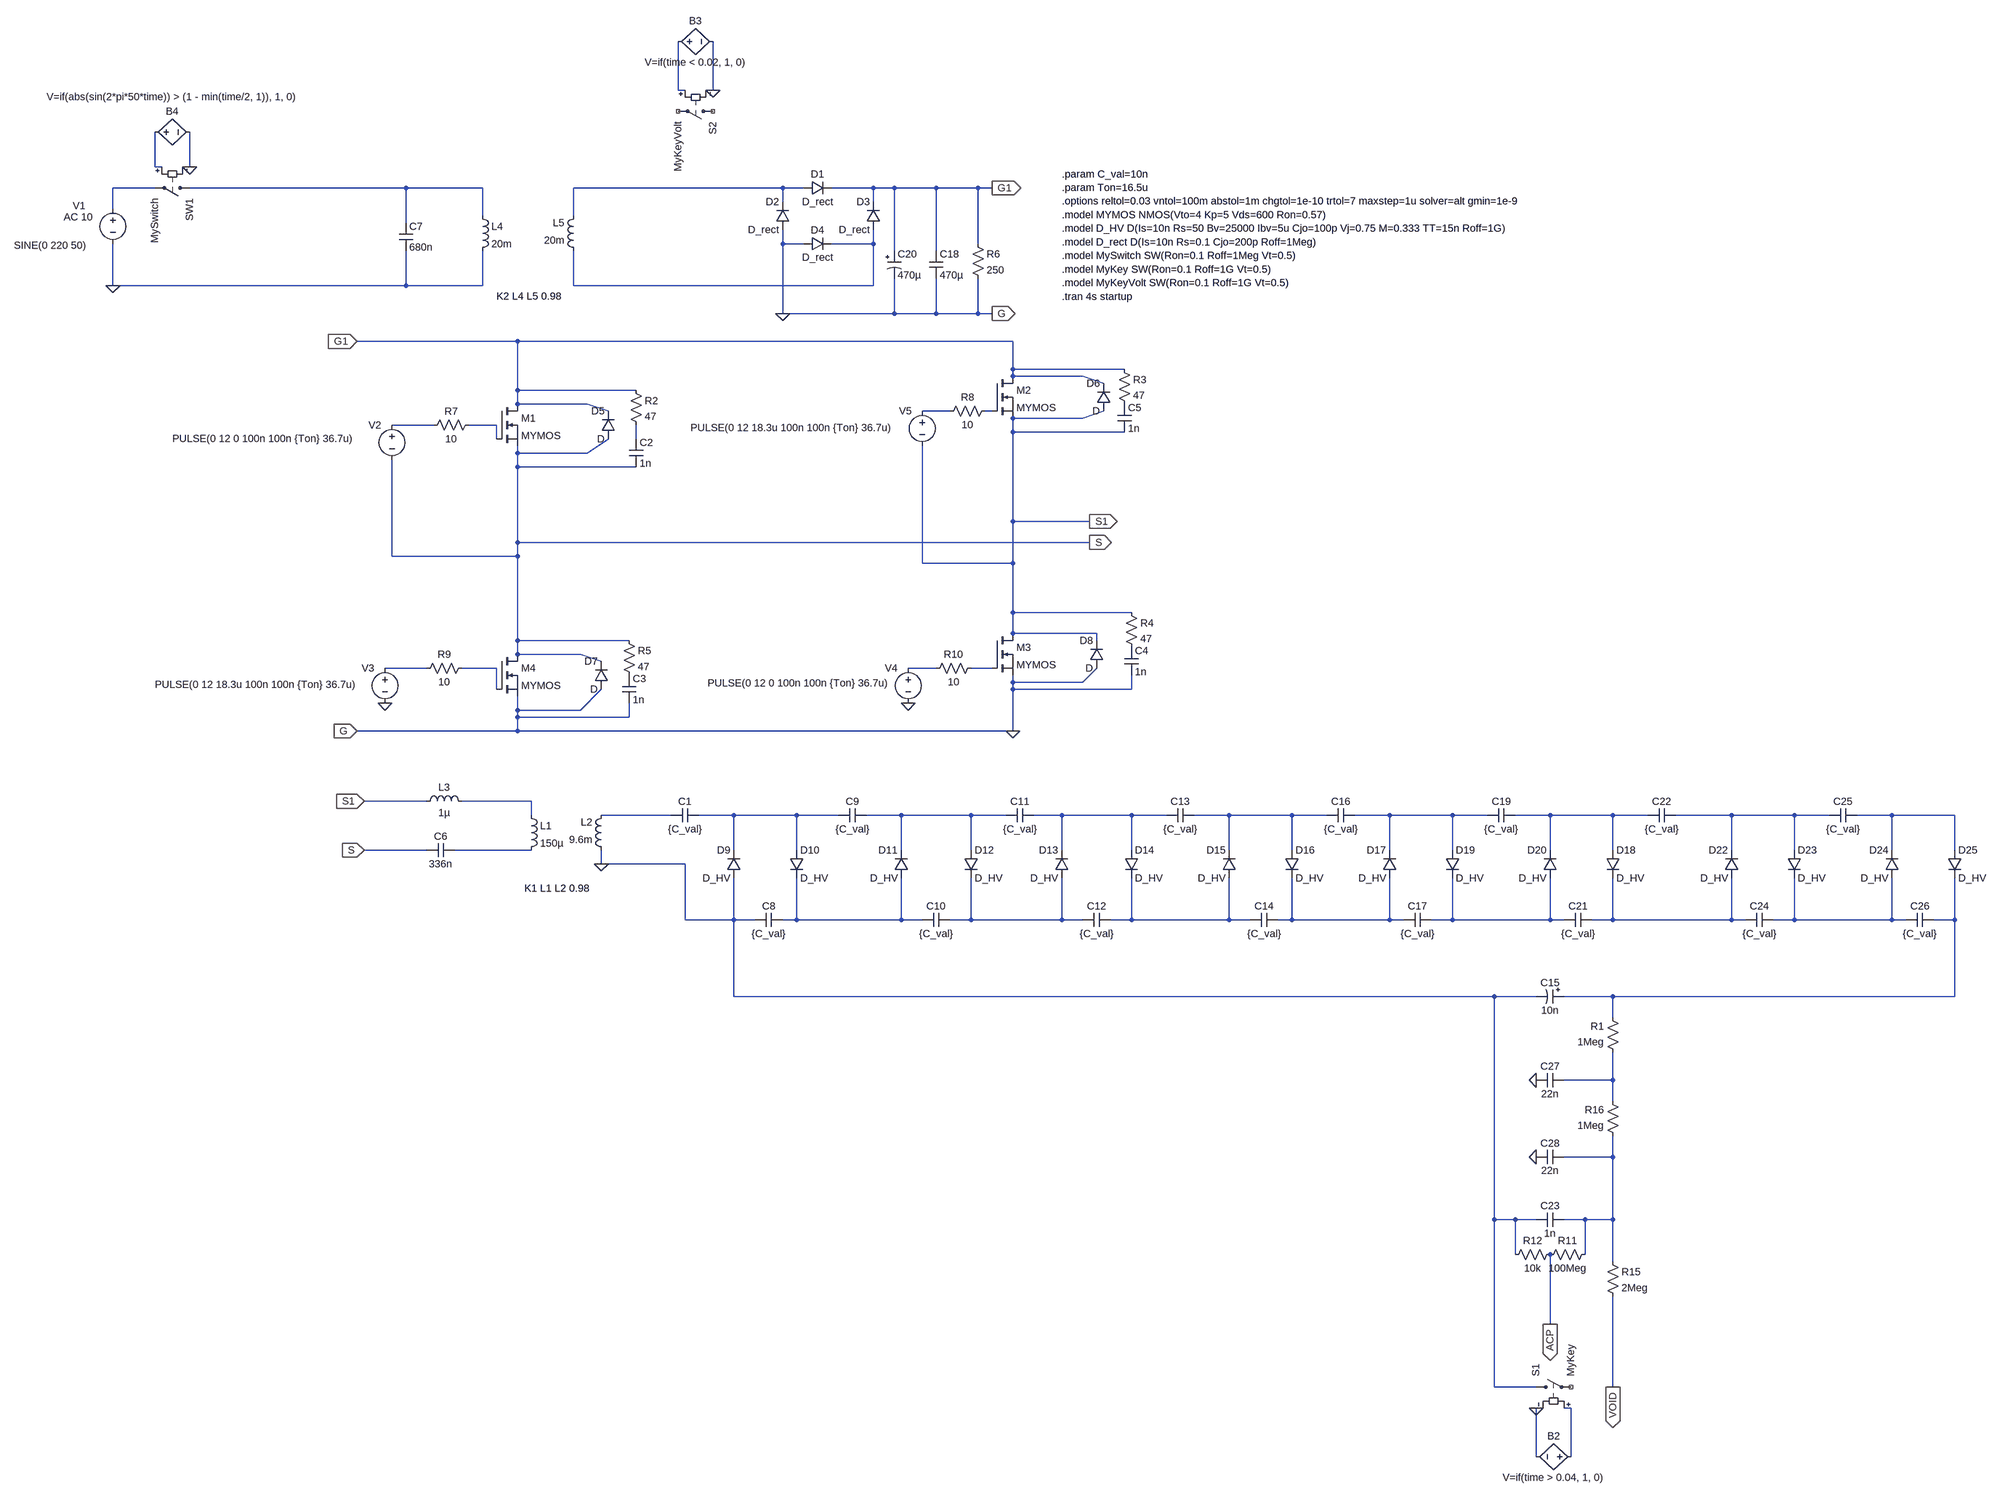
[diagram p0: schematic Higt.asc]
Higt.asc, the LTspice schematic file:
Version 4.1
SHEET 1 3056 2752
WIRE -448 -592 -448 -704
WIRE -432 -592 -448 -592
WIRE -368 -592 -368 -704
WIRE -368 -592 -384 -592
WIRE -1648 -416 -1648 -496
WIRE -1632 -416 -1648 -416
WIRE -1568 -416 -1568 -496
WIRE -1568 -416 -1584 -416
WIRE -1648 -368 -1744 -368
WIRE -1072 -368 -1568 -368
WIRE -896 -368 -1072 -368
WIRE -208 -368 -688 -368
WIRE -160 -368 -208 -368
WIRE 0 -368 -96 -368
WIRE 48 -368 0 -368
WIRE 144 -368 48 -368
WIRE 240 -368 144 -368
WIRE 272 -368 240 -368
WIRE -208 -336 -208 -368
WIRE 0 -336 0 -368
WIRE -1744 -320 -1744 -368
WIRE -896 -304 -896 -368
WIRE -688 -304 -688 -368
WIRE -1072 -288 -1072 -368
WIRE -208 -240 -208 -272
WIRE -160 -240 -208 -240
WIRE 0 -240 0 -272
WIRE 0 -240 -96 -240
WIRE 240 -240 240 -368
WIRE 48 -224 48 -368
WIRE 144 -224 144 -368
WIRE -1744 -144 -1744 -240
WIRE -1072 -144 -1072 -224
WIRE -1072 -144 -1744 -144
WIRE -896 -144 -896 -224
WIRE -896 -144 -1072 -144
WIRE -688 -144 -688 -224
WIRE 0 -144 0 -240
WIRE 0 -144 -688 -144
WIRE -208 -80 -208 -240
WIRE 48 -80 48 -160
WIRE 48 -80 -208 -80
WIRE 144 -80 144 -160
WIRE 144 -80 48 -80
WIRE 240 -80 240 -160
WIRE 240 -80 144 -80
WIRE 272 -80 240 -80
WIRE -816 -16 -1184 -16
WIRE 320 -16 -816 -16
WIRE 320 48 320 -16
WIRE 576 48 320 48
WIRE 320 64 320 48
WIRE 480 64 320 64
WIRE 528 80 480 64
WIRE -816 96 -816 -16
WIRE -544 96 -816 96
WIRE -816 128 -816 96
WIRE -656 128 -816 128
WIRE -608 144 -656 128
WIRE 176 144 112 144
WIRE 272 144 256 144
WIRE 480 160 528 144
WIRE 480 160 320 160
WIRE -1008 176 -1104 176
WIRE -864 176 -928 176
WIRE 320 192 320 160
WIRE 576 192 320 192
WIRE -864 208 -864 176
WIRE -544 208 -544 176
WIRE -816 240 -816 224
WIRE -656 240 -608 208
WIRE -656 240 -816 240
WIRE -816 272 -816 240
WIRE -544 272 -816 272
WIRE 320 432 320 192
WIRE 496 432 320 432
WIRE -816 480 -816 272
WIRE 496 480 -816 480
WIRE -1104 512 -1104 256
WIRE -816 512 -816 480
WIRE -816 512 -1104 512
WIRE 112 528 112 224
WIRE 320 528 320 432
WIRE 320 528 112 528
WIRE 320 736 320 528
WIRE 592 736 320 736
WIRE 320 784 320 736
WIRE 512 784 320 784
WIRE -816 800 -816 512
WIRE -560 800 -816 800
WIRE 512 800 512 784
WIRE -816 832 -816 800
WIRE -672 832 -816 832
WIRE -624 848 -672 832
WIRE -1024 864 -1120 864
WIRE -864 864 -944 864
WIRE 144 864 80 864
WIRE 272 864 224 864
WIRE 320 896 320 880
WIRE 480 896 512 864
WIRE 480 896 320 896
WIRE -864 912 -864 864
WIRE 320 912 320 896
WIRE 592 912 592 880
WIRE 592 912 320 912
WIRE -816 960 -816 928
WIRE -672 960 -624 912
WIRE -672 960 -816 960
WIRE -816 976 -816 960
WIRE -560 976 -560 944
WIRE -560 976 -816 976
WIRE -816 1008 -816 976
WIRE -816 1008 -1184 1008
WIRE 320 1008 320 912
WIRE 320 1008 -816 1008
WIRE -1024 1184 -1168 1184
WIRE -784 1184 -944 1184
WIRE -784 1216 -784 1184
WIRE -464 1216 -624 1216
WIRE -320 1216 -400 1216
WIRE -176 1216 -320 1216
WIRE -80 1216 -176 1216
WIRE 64 1216 -16 1216
WIRE 224 1216 64 1216
WIRE 304 1216 224 1216
WIRE 432 1216 368 1216
WIRE 592 1216 432 1216
WIRE 672 1216 592 1216
WIRE 816 1216 736 1216
WIRE 960 1216 816 1216
WIRE 1040 1216 960 1216
WIRE 1184 1216 1104 1216
WIRE 1328 1216 1184 1216
WIRE 1408 1216 1328 1216
WIRE 1552 1216 1472 1216
WIRE 1696 1216 1552 1216
WIRE 1776 1216 1696 1216
WIRE 1968 1216 1840 1216
WIRE 2112 1216 1968 1216
WIRE 2192 1216 2112 1216
WIRE 2336 1216 2256 1216
WIRE 2480 1216 2336 1216
WIRE -1024 1296 -1168 1296
WIRE -784 1296 -960 1296
WIRE -320 1296 -320 1216
WIRE -176 1296 -176 1216
WIRE 64 1296 64 1216
WIRE 224 1296 224 1216
WIRE 432 1296 432 1216
WIRE 592 1296 592 1216
WIRE 816 1296 816 1216
WIRE 960 1296 960 1216
WIRE 1184 1296 1184 1216
WIRE 1328 1296 1328 1216
WIRE 1552 1296 1552 1216
WIRE 1696 1296 1696 1216
WIRE 1968 1296 1968 1216
WIRE 2112 1296 2112 1216
WIRE 2336 1296 2336 1216
WIRE 2480 1296 2480 1216
WIRE -624 1328 -624 1296
WIRE -432 1328 -624 1328
WIRE -432 1456 -432 1328
WIRE -320 1456 -320 1360
WIRE -320 1456 -432 1456
WIRE -272 1456 -320 1456
WIRE -176 1456 -176 1360
WIRE -176 1456 -208 1456
WIRE 64 1456 64 1360
WIRE 64 1456 -176 1456
WIRE 112 1456 64 1456
WIRE 224 1456 224 1360
WIRE 224 1456 176 1456
WIRE 432 1456 432 1360
WIRE 432 1456 224 1456
WIRE 480 1456 432 1456
WIRE 592 1456 592 1360
WIRE 592 1456 544 1456
WIRE 816 1456 816 1360
WIRE 816 1456 592 1456
WIRE 864 1456 816 1456
WIRE 960 1456 960 1360
WIRE 960 1456 928 1456
WIRE 1184 1456 1184 1360
WIRE 1184 1456 960 1456
WIRE 1216 1456 1184 1456
WIRE 1328 1456 1328 1360
WIRE 1328 1456 1280 1456
WIRE 1552 1456 1552 1360
WIRE 1552 1456 1328 1456
WIRE 1584 1456 1552 1456
WIRE 1696 1456 1696 1360
WIRE 1696 1456 1648 1456
WIRE 1968 1456 1968 1360
WIRE 1968 1456 1696 1456
WIRE 2000 1456 1968 1456
WIRE 2112 1456 2112 1360
WIRE 2112 1456 2064 1456
WIRE 2336 1456 2336 1360
WIRE 2336 1456 2112 1456
WIRE 2368 1456 2336 1456
WIRE 2480 1456 2480 1360
WIRE 2480 1456 2432 1456
WIRE -320 1632 -320 1456
WIRE 1424 1632 -320 1632
WIRE 1520 1632 1424 1632
WIRE 1696 1632 1584 1632
WIRE 2480 1632 2480 1456
WIRE 2480 1632 1696 1632
WIRE 1696 1680 1696 1632
WIRE 1696 1824 1696 1760
WIRE 1696 1824 1584 1824
WIRE 1696 1872 1696 1824
WIRE 1696 2000 1696 1952
WIRE 1696 2000 1584 2000
WIRE 1424 2144 1424 1632
WIRE 1472 2144 1424 2144
WIRE 1520 2144 1472 2144
WIRE 1632 2144 1584 2144
WIRE 1696 2144 1696 2000
WIRE 1696 2144 1632 2144
WIRE 1472 2224 1472 2144
WIRE 1632 2224 1632 2144
WIRE 1696 2240 1696 2144
WIRE 1552 2384 1552 2224
WIRE 1424 2528 1424 2144
WIRE 1520 2528 1424 2528
WIRE 1696 2528 1696 2320
WIRE 1536 2576 1520 2576
WIRE 1600 2576 1584 2576
WIRE 1520 2688 1520 2576
WIRE 1600 2688 1600 2576
FLAG -1120 944 0
FLAG 80 944 0
FLAG -624 1328 0
FLAG 272 -80 G
IOPIN 272 -80 Out
FLAG 272 -368 G1
IOPIN 272 -368 Out
FLAG -1184 -16 G1
IOPIN -1184 -16 In
FLAG -1184 1008 G
IOPIN -1184 1008 In
FLAG 496 432 S1
IOPIN 496 432 Out
FLAG -1168 1184 S1
IOPIN -1168 1184 In
FLAG 496 480 S
IOPIN 496 480 Out
FLAG -1168 1296 S
IOPIN -1168 1296 In
FLAG 320 1008 0
FLAG -208 -80 0
FLAG -1744 -144 0
FLAG 1552 2384 ACP
IOPIN 1552 2384 Out
FLAG 1520 2576 0
FLAG -368 -592 0
FLAG 1696 2528 VOID
IOPIN 1696 2528 Out
FLAG 1520 1824 0
FLAG 1520 2000 0
FLAG -1568 -416 0
SYMBOL voltage -1744 -336 R0
WINDOW 123 -113 35 Left 2
WINDOW 39 0 0 Left 0
WINDOW 0 -92 9 Left 2
WINDOW 3 -227 100 Left 2
SYMATTR Value2 AC 10
SYMATTR InstName V1
SYMATTR Value SINE(0 220 50)
SYMBOL diode -160 -352 R270
WINDOW 0 32 32 VTop 2
WINDOW 3 0 32 VBottom 2
SYMATTR InstName D1
SYMATTR Value D_rect
SYMBOL diode -192 -272 R180
WINDOW 0 24 64 Left 2
WINDOW 3 24 0 Left 2
SYMATTR InstName D2
SYMATTR Value D_rect
SYMBOL diode 16 -272 R180
WINDOW 0 24 64 Left 2
WINDOW 3 24 0 Left 2
SYMATTR InstName D3
SYMATTR Value D_rect
SYMBOL diode -160 -224 R270
WINDOW 0 32 32 VTop 2
WINDOW 3 0 32 VBottom 2
SYMATTR InstName D4
SYMATTR Value D_rect
SYMBOL voltage -1104 160 M0
WINDOW 3 87 47 Left 2
SYMATTR Value PULSE(0 12 0 100n 100n {Ton} 36.7u)
SYMATTR InstName V2
SYMBOL voltage -1120 848 M0
WINDOW 3 64 53 Left 2
SYMATTR Value PULSE(0 12 18.3u 100n 100n {Ton} 36.7u)
SYMATTR InstName V3
SYMBOL voltage 80 848 M0
WINDOW 3 44 50 Left 2
SYMATTR Value PULSE(0 12 0 100n 100n {Ton} 36.7u)
SYMATTR InstName V4
SYMBOL voltage 112 128 M0
WINDOW 3 68 54 Left 2
SYMATTR Value PULSE(0 12 18.3u 100n 100n {Ton} 36.7u)
SYMATTR InstName V5
SYMBOL ind -800 1200 R0
SYMATTR InstName L1
SYMATTR Value 150µ
SYMATTR Type ind
SYMATTR SpiceLine Rser=0.05
SYMBOL ind -608 1312 R180
WINDOW 0 36 80 Left 2
WINDOW 3 36 40 Left 2
SYMATTR InstName L2
SYMATTR Value 9.6m
SYMATTR Type ind
SYMATTR SpiceLine Rser=300 Cpar=16p
SYMBOL diode -592 208 R180
WINDOW 0 24 64 Left 2
WINDOW 3 24 0 Left 2
SYMATTR InstName D5
SYMBOL diode 544 144 R180
WINDOW 0 24 64 Left 2
WINDOW 3 24 0 Left 2
SYMATTR InstName D6
SYMBOL diode -608 912 R180
WINDOW 0 24 64 Left 2
WINDOW 3 24 0 Left 2
SYMATTR InstName D7
SYMBOL diode 528 864 R180
WINDOW 0 24 64 Left 2
WINDOW 3 24 0 Left 2
SYMATTR InstName D8
SYMBOL nmos -864 128 R0
SYMATTR InstName M1
SYMATTR Value MYMOS
SYMBOL nmos 272 64 R0
SYMATTR InstName M2
SYMATTR Value MYMOS
SYMBOL nmos 272 784 R0
SYMATTR InstName M3
SYMATTR Value MYMOS
SYMBOL nmos -864 832 R0
SYMATTR InstName M4
SYMATTR Value MYMOS
SYMBOL res -560 80 R0
SYMATTR InstName R2
SYMATTR Value 47
SYMBOL cap -560 208 R0
SYMATTR InstName C2
SYMATTR Value 1n
SYMBOL res 560 32 R0
SYMATTR InstName R3
SYMATTR Value 47
SYMBOL res 576 720 R0
SYMATTR InstName R4
SYMATTR Value 47
SYMBOL res -576 784 R0
SYMATTR InstName R5
SYMATTR Value 47
SYMBOL cap -576 880 R0
SYMATTR InstName C3
SYMATTR Value 1n
SYMBOL cap 576 816 R0
SYMATTR InstName C4
SYMATTR Value 1n
SYMBOL cap 560 128 R0
SYMATTR InstName C5
SYMATTR Value 1n
SYMBOL res 224 -256 R0
SYMATTR InstName R6
SYMATTR Value 250
SYMBOL cap -1088 -288 R0
SYMATTR InstName C7
SYMATTR Value 680n
SYMATTR SpiceLine Rser=2
SYMBOL polcap 32 -224 R0
SYMATTR InstName C20
SYMATTR Value 470µ
SYMATTR SpiceLine Rser=0.01
SYMBOL cap -400 1200 R90
WINDOW 0 0 32 VBottom 2
WINDOW 3 32 32 VTop 2
SYMATTR InstName C1
SYMATTR Value {C_val}
SYMBOL diode -304 1360 R180
WINDOW 0 24 64 Left 2
WINDOW 3 24 0 Left 2
SYMATTR InstName D9
SYMATTR Value D_HV
SYMBOL diode -192 1296 R0
SYMATTR InstName D10
SYMATTR Value D_HV
SYMBOL cap -208 1440 R90
WINDOW 0 0 32 VBottom 2
WINDOW 3 32 32 VTop 2
SYMATTR InstName C8
SYMATTR Value {C_val}
SYMBOL cap -16 1200 R90
WINDOW 0 0 32 VBottom 2
WINDOW 3 32 32 VTop 2
SYMATTR InstName C9
SYMATTR Value {C_val}
SYMBOL diode 80 1360 R180
WINDOW 0 24 64 Left 2
WINDOW 3 24 0 Left 2
SYMATTR InstName D11
SYMATTR Value D_HV
SYMBOL diode 208 1296 R0
SYMATTR InstName D12
SYMATTR Value D_HV
SYMBOL cap 368 1200 R90
WINDOW 0 0 32 VBottom 2
WINDOW 3 32 32 VTop 2
SYMATTR InstName C11
SYMATTR Value {C_val}
SYMBOL diode 448 1360 R180
WINDOW 0 24 64 Left 2
WINDOW 3 24 0 Left 2
SYMATTR InstName D13
SYMATTR Value D_HV
SYMBOL diode 576 1296 R0
SYMATTR InstName D14
SYMATTR Value D_HV
SYMBOL cap 544 1440 R90
WINDOW 0 0 32 VBottom 2
WINDOW 3 32 32 VTop 2
SYMATTR InstName C12
SYMATTR Value {C_val}
SYMBOL cap 736 1200 R90
WINDOW 0 0 32 VBottom 2
WINDOW 3 32 32 VTop 2
SYMATTR InstName C13
SYMATTR Value {C_val}
SYMBOL diode 832 1360 R180
WINDOW 0 24 64 Left 2
WINDOW 3 24 0 Left 2
SYMATTR InstName D15
SYMATTR Value D_HV
SYMBOL diode 944 1296 R0
SYMATTR InstName D16
SYMATTR Value D_HV
SYMBOL cap 928 1440 R90
WINDOW 0 0 32 VBottom 2
WINDOW 3 32 32 VTop 2
SYMATTR InstName C14
SYMATTR Value {C_val}
SYMBOL polcap 1584 1616 R90
WINDOW 0 0 32 VBottom 2
WINDOW 3 32 32 VTop 2
SYMATTR InstName C15
SYMATTR Value 10n
SYMATTR SpiceLine Rser=2
SYMBOL res -912 160 R90
WINDOW 0 0 56 VBottom 2
WINDOW 3 32 56 VTop 2
SYMATTR InstName R7
SYMATTR Value 10
SYMBOL res 272 128 R90
WINDOW 0 0 56 VBottom 2
WINDOW 3 32 56 VTop 2
SYMATTR InstName R8
SYMATTR Value 10
SYMBOL res -928 848 R90
WINDOW 0 0 56 VBottom 2
WINDOW 3 32 56 VTop 2
SYMATTR InstName R9
SYMATTR Value 10
SYMBOL res 240 848 R90
WINDOW 0 0 56 VBottom 2
WINDOW 3 32 56 VTop 2
SYMATTR InstName R10
SYMATTR Value 10
SYMBOL diode 1200 1360 R180
WINDOW 0 24 64 Left 2
WINDOW 3 24 0 Left 2
SYMATTR InstName D17
SYMATTR Value D_HV
SYMBOL cap 1104 1200 R90
WINDOW 0 0 32 VBottom 2
WINDOW 3 32 32 VTop 2
SYMATTR InstName C16
SYMATTR Value {C_val}
SYMBOL cap 1280 1440 R90
WINDOW 0 0 32 VBottom 2
WINDOW 3 32 32 VTop 2
SYMATTR InstName C17
SYMATTR Value {C_val}
SYMBOL ind -672 -208 R180
WINDOW 0 36 80 Left 2
WINDOW 3 36 40 Left 2
SYMATTR InstName L5
SYMATTR Value 20m
SYMATTR Type ind
SYMATTR SpiceLine Rser=1
SYMBOL cap 176 1440 R90
WINDOW 0 0 32 VBottom 2
WINDOW 3 32 32 VTop 2
SYMATTR InstName C10
SYMATTR Value {C_val}
SYMBOL ind -1040 1200 R270
WINDOW 0 32 56 VTop 2
WINDOW 3 5 56 VBottom 2
SYMATTR InstName L3
SYMATTR Value 1µ
SYMATTR SpiceLine Rser=0.5
SYMBOL cap -960 1280 R90
WINDOW 0 0 32 VBottom 2
WINDOW 3 32 32 VTop 2
SYMATTR InstName C6
SYMATTR Value 336n
SYMATTR SpiceLine Rser=0.05
SYMBOL diode 1312 1296 R0
SYMATTR InstName D19
SYMATTR Value D_HV
SYMBOL diode 1568 1360 R180
WINDOW 0 24 64 Left 2
WINDOW 3 24 0 Left 2
SYMATTR InstName D20
SYMATTR Value D_HV
SYMBOL cap 1472 1200 R90
WINDOW 0 0 32 VBottom 2
WINDOW 3 32 32 VTop 2
SYMATTR InstName C19
SYMATTR Value {C_val}
SYMBOL cap 1648 1440 R90
WINDOW 0 0 32 VBottom 2
WINDOW 3 32 32 VTop 2
SYMATTR InstName C21
SYMATTR Value {C_val}
SYMBOL cap 128 -224 R0
SYMATTR InstName C18
SYMATTR Value 470µ
SYMBOL ind -912 -320 R0
SYMATTR InstName L4
SYMATTR Value 20m
SYMATTR Type ind
SYMATTR SpiceLine Rser=1
SYMBOL res 1712 1776 R180
WINDOW 0 36 76 Left 2
WINDOW 3 36 40 Left 2
SYMATTR InstName R1
SYMATTR Value 1Meg
SYMBOL cap 1520 2160 R270
WINDOW 0 32 32 VTop 2
WINDOW 3 0 32 VBottom 2
SYMATTR InstName C23
SYMATTR Value 1n
SYMBOL res 1648 2208 R90
WINDOW 0 0 56 VBottom 2
WINDOW 3 32 56 VTop 2
SYMATTR InstName R11
SYMATTR Value 100Meg
SYMBOL res 1568 2208 R90
WINDOW 0 0 56 VBottom 2
WINDOW 3 32 56 VTop 2
SYMATTR InstName R12
SYMATTR Value 10k
SYMBOL sw 1504 2528 R270
SYMATTR InstName S1
SYMATTR Value MyKey
SYMBOL bv 1616 2688 R90
WINDOW 0 -32 56 VBottom 2
WINDOW 3 32 56 VTop 2
SYMATTR InstName B2
SYMATTR Value V=if(time > 0.04, 1, 0)
SYMBOL sw -352 -544 R90
SYMATTR InstName S2
SYMATTR Value MyKeyVolt
SYMBOL bv -464 -704 R270
WINDOW 0 32 56 VTop 2
WINDOW 3 -32 56 VBottom 2
SYMATTR InstName B3
SYMATTR Value V=if(time < 0.02, 1, 0)
SYMBOL diode 1680 1296 R0
SYMATTR InstName D18
SYMATTR Value D_HV
SYMBOL diode 1984 1360 R180
WINDOW 0 24 64 Left 2
WINDOW 3 24 0 Left 2
SYMATTR InstName D22
SYMATTR Value D_HV
SYMBOL cap 1840 1200 R90
WINDOW 0 0 32 VBottom 2
WINDOW 3 32 32 VTop 2
SYMATTR InstName C22
SYMATTR Value {C_val}
SYMBOL cap 2064 1440 R90
WINDOW 0 0 32 VBottom 2
WINDOW 3 32 32 VTop 2
SYMATTR InstName C24
SYMATTR Value {C_val}
SYMBOL diode 2096 1296 R0
SYMATTR InstName D23
SYMATTR Value D_HV
SYMBOL diode 2352 1360 R180
WINDOW 0 24 64 Left 2
WINDOW 3 24 0 Left 2
SYMATTR InstName D24
SYMATTR Value D_HV
SYMBOL cap 2256 1200 R90
WINDOW 0 0 32 VBottom 2
WINDOW 3 32 32 VTop 2
SYMATTR InstName C25
SYMATTR Value {C_val}
SYMBOL diode 2464 1296 R0
SYMATTR InstName D25
SYMATTR Value D_HV
SYMBOL cap 2432 1440 R90
WINDOW 0 0 32 VBottom 2
WINDOW 3 32 32 VTop 2
SYMATTR InstName C26
SYMATTR Value {C_val}
SYMBOL res 1680 2224 R0
SYMATTR InstName R15
SYMATTR Value 2Meg
SYMBOL cap 1520 1840 R270
WINDOW 0 32 32 VTop 2
WINDOW 3 0 32 VBottom 2
SYMATTR InstName C27
SYMATTR Value 22n
SYMBOL cap 1520 2016 R270
WINDOW 0 32 32 VTop 2
WINDOW 3 0 32 VBottom 2
SYMATTR InstName C28
SYMATTR Value 22n
SYMBOL res 1712 1968 R180
WINDOW 0 36 76 Left 2
WINDOW 3 36 40 Left 2
SYMATTR InstName R16
SYMATTR Value 1Meg
SYMBOL sw -1552 -368 R90
SYMATTR InstName SW1
SYMATTR Value MySwitch
SYMBOL bv -1664 -496 R270
WINDOW 0 32 56 VTop 2
WINDOW 3 97 56 VBottom 2
SYMATTR InstName B4
SYMATTR Value V=if(abs(sin(2*pi*50*time)) > (1 - min(time/2, 1)), 1, 0)
TEXT -800 1384 Left 2 !K1 L1 L2 0.98
TEXT 432 -400 Left 2 !.param C_val=10n\n.param Ton=16.5u\n.options reltol=0.03 vntol=100m abstol=1m chgtol=1e-10 trtol=7 maxstep=1u solver=alt gmin=1e-9\n.model MYMOS NMOS(Vto=4 Kp=5 Vds=600 Ron=0.57)\n.model D_HV D(Is=10n Rs=50 Bv=25000 Ibv=5u Cjo=100p Vj=0.75 M=0.333 TT=15n Roff=1G)\n.model D_rect D(Is=10n Rs=0.1 Cjo=200p Roff=1Meg)\n.model MySwitch SW(Ron=0.1 Roff=1Meg Vt=0.5)\n.model MyKey SW(Ron=0.1 Roff=1G Vt=0.5)\n.model MyKeyVolt SW(Ron=0.1 Roff=1G Vt=0.5)\n.tran 4s startup
TEXT -864 -120 Left 2 !K2 L4 L5 0.98

The netlist it stands for:
* Higt.asc
V1 N003 0 SINE(0 220 50) AC 10
D1 N005 G1 D_rect
D2 0 N005 D_rect
D3 N006 G1 D_rect
D4 0 N006 D_rect
V2 N009 S PULSE(0 12 0 100n 100n {Ton} 36.7u)
V3 N012 0 PULSE(0 12 18.3u 100n 100n {Ton} 36.7u)
V4 N014 0 PULSE(0 12 0 100n 100n {Ton} 36.7u)
V5 N007 S1 PULSE(0 12 18.3u 100n 100n {Ton} 36.7u)
L1 N016 N026 150µ Rser=0.05
L2 0 N017 9.6m Rser=300 Cpar=16p
D5 S G1 D
D6 S1 G1 D
D7 0 S D
D8 0 S1 D
M1 G1 N010 S S MYMOS
M2 G1 N008 S1 S1 MYMOS
M3 S1 N015 0 0 MYMOS
M4 S N013 0 0 MYMOS
R2 G1 N011 47
C2 N011 S 1n
R3 G1 P001 47
R4 S1 P002 47
R5 S P003 47
C3 P003 0 1n
C4 P002 0 1n
C5 P001 S1 1n
R6 G1 0 250
C7 N004 0 680n Rser=2
C20 G1 0 470µ Rser=0.01
C1 N018 N017 {C_val}
D9 0 N018 D_HV
D10 N018 N027 D_HV
C8 N027 0 {C_val}
C9 N019 N018 {C_val}
D11 N027 N019 D_HV
D12 N019 N028 D_HV
C11 N020 N019 {C_val}
D13 N028 N020 D_HV
D14 N020 N029 D_HV
C12 N029 N028 {C_val}
C13 N021 N020 {C_val}
D15 N029 N021 D_HV
D16 N021 N030 D_HV
C14 N030 N029 {C_val}
C15 N034 0 10n Rser=2
R7 N010 N009 10
R8 N008 N007 10
R9 N013 N012 10
R10 N015 N014 10
D17 N030 N022 D_HV
C16 N022 N021 {C_val}
C17 N031 N030 {C_val}
L5 N006 N005 20m Rser=1
C10 N028 N027 {C_val}
L3 S1 N016 1µ Rser=0.5
C6 N026 S 336n Rser=0.05
D19 N022 N031 D_HV
D20 N031 N023 D_HV
C19 N023 N022 {C_val}
C21 N032 N031 {C_val}
C18 G1 0 470µ
L4 N004 0 20m Rser=1
R1 N035 N034 1Meg
C23 0 N036 1n
R11 N036 ACP 100Meg
R12 ACP 0 10k
S1 0 NC_01 N037 0 MyKey
B2 N037 0 V=if(time > 0.04, 1, 0)
S2 NC_02 NC_03 N001 0 MyKeyVolt
B3 N001 0 V=if(time < 0.02, 1, 0)
D18 N023 N032 D_HV
D22 N032 N024 D_HV
C22 N024 N023 {C_val}
C24 N033 N032 {C_val}
D23 N024 N033 D_HV
D24 N033 N025 D_HV
C25 N025 N024 {C_val}
D25 N025 N034 D_HV
C26 N034 N033 {C_val}
R15 N036 VOID 2Meg
C27 0 N035 22n
C28 0 N036 22n
R16 N036 N035 1Meg
SW1 N004 N003 N002 0 MySwitch
B4 N002 0 V=if(abs(sin(2*pi*50*time)) > (1 - min(time/2, 1)), 1, 0)
.model D D
.lib standard.dio
.model NMOS NMOS
.model PMOS PMOS
.lib standard.mos
K1 L1 L2 0.98
.param C_val=10n
.param Ton=16.5u
.options reltol=0.03 vntol=100m abstol=1m chgtol=1e-10 trtol=7 maxstep=1u solver=alt gmin=1e-9
.model MYMOS NMOS(Vto=4 Kp=5 Vds=600 Ron=0.57)
.model D_HV D(Is=10n Rs=50 Bv=25000 Ibv=5u Cjo=100p Vj=0.75 M=0.333 TT=15n Roff=1G)
.model D_rect D(Is=10n Rs=0.1 Cjo=200p Roff=1Meg)
.model MySwitch SW(Ron=0.1 Roff=1Meg Vt=0.5)
.model MyKey SW(Ron=0.1 Roff=1G Vt=0.5)
.model MyKeyVolt SW(Ron=0.1 Roff=1G Vt=0.5)
.tran 4s startup
K2 L4 L5 0.98
.backanno
.end